# EAGLE design spoke-motor (EAGLE 5.10)
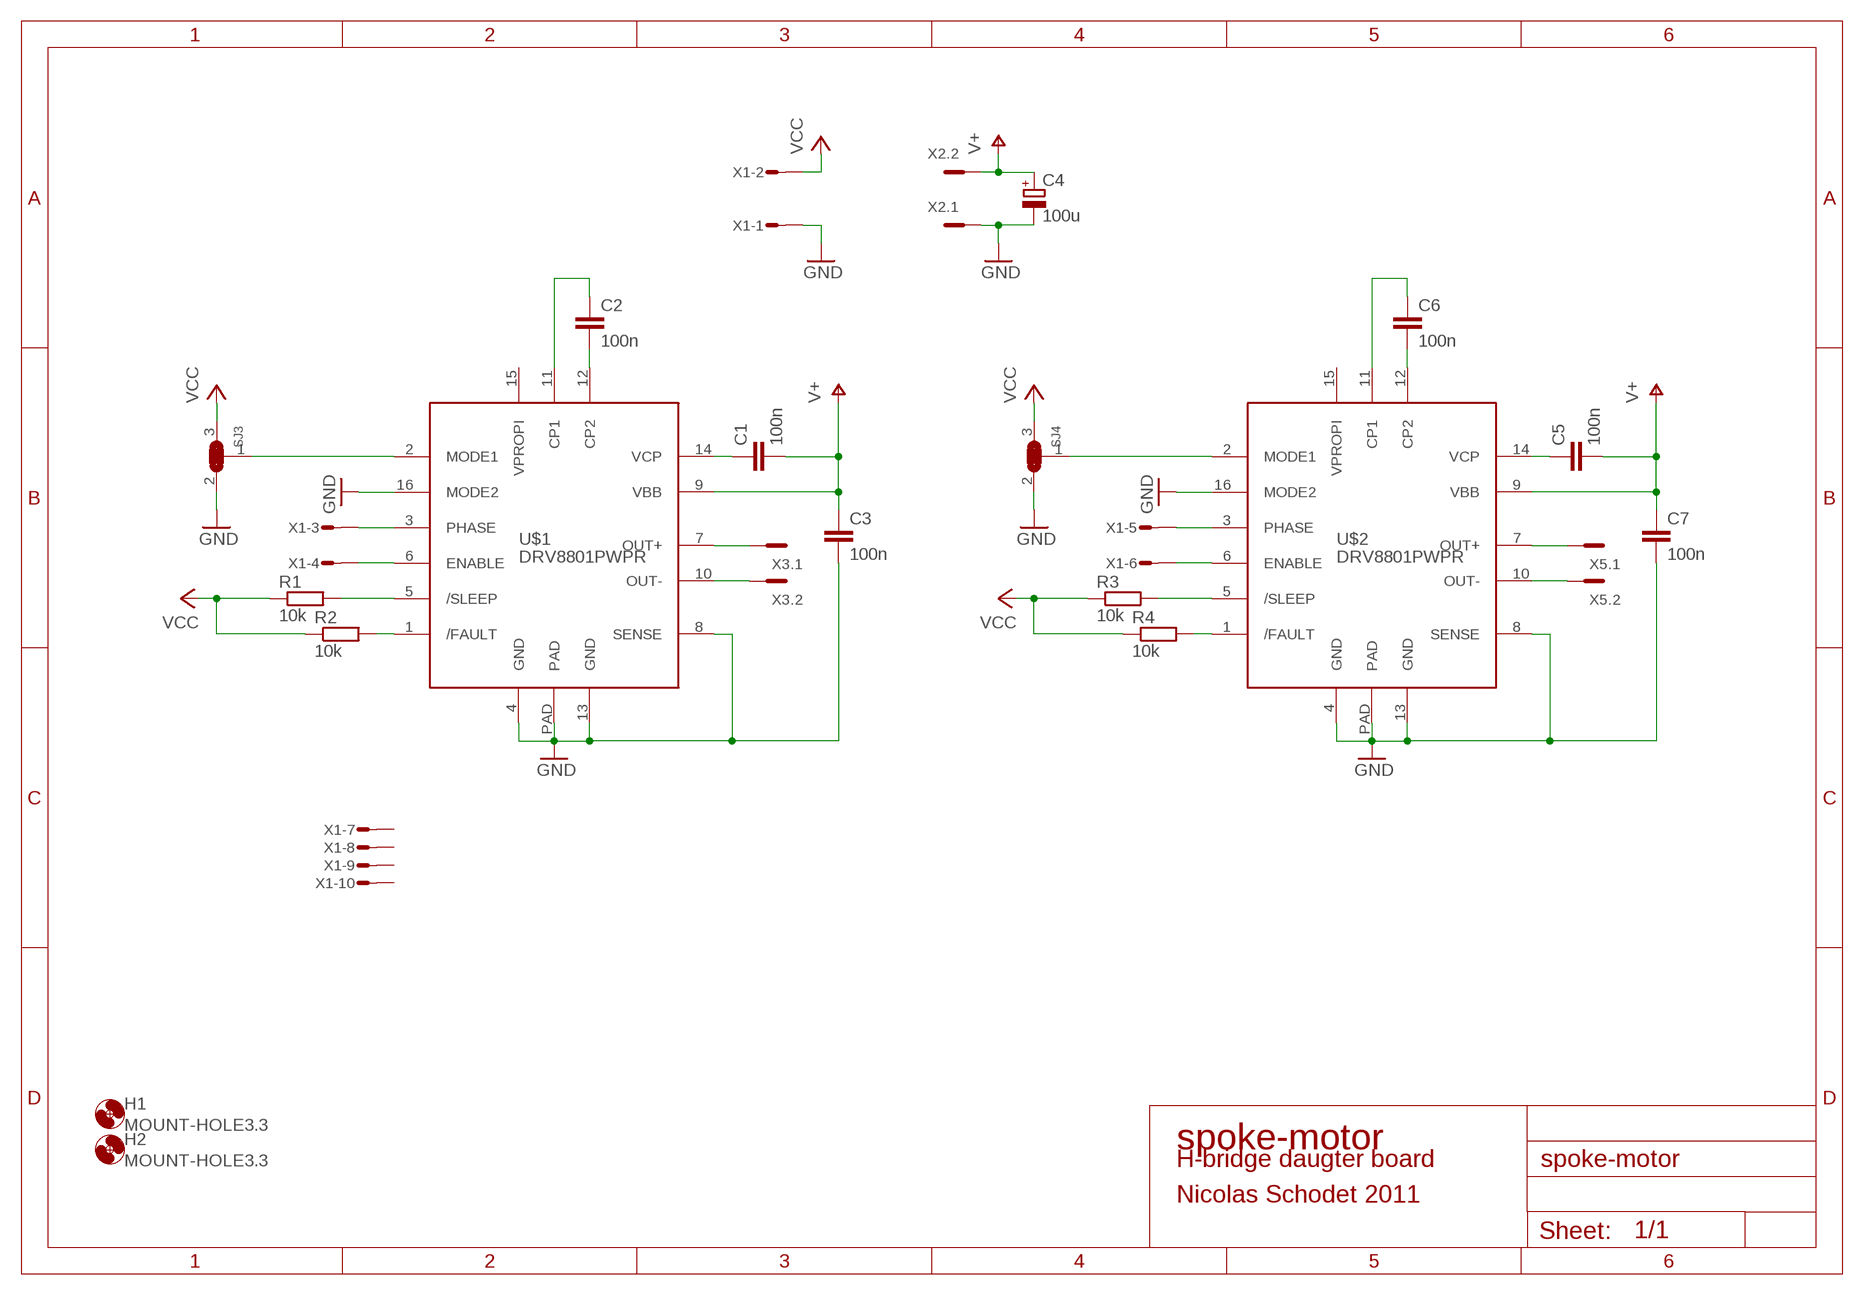
[diagram p0: schematic, sheet 1]

## Parts
C1  100n  C-EUC0603  [C0603]
C2  100n  C-EUC0603  [C0603]
C3  100n  C-EUC0603  [C0603]
C4  100u  CPOL-EUE3.5-8  [E3,5-8]
C5  100n  C-EUC0603  [C0603]
C6  100n  C-EUC0603  [C0603]
C7  100n  C-EUC0603  [C0603]
H1  MOUNT-HOLE3.3  [3,3]
H2  MOUNT-HOLE3.3  [3,3]
R1  10k  R-EU_R0603  [R0603]
R2  10k  R-EU_R0603  [R0603]
R3  10k  R-EU_R0603  [R0603]
R4  10k  R-EU_R0603  [R0603]
SJ3  SJ2SMD  [SJ2-SMD]
SJ4  SJ2SMD  [SJ2-SMD]
U$1  DRV8801PWPR  [HTSSOP16]
U$2  DRV8801PWPR  [HTSSOP16]
X1  MICROMATCH-10  [MICROMATCH-10]
X2  MC2  [MC2]
X3  MC2  [MC2]
X5  MC2  [MC2]

## Nets
CP10: C2.1 U$1.11(CP1)
CP11: C6.1 U$2.11(CP1)
CP20: C2.2 U$1.12(CP2)
CP21: C6.2 U$2.12(CP2)
ENABLE0: U$1.6(ENABLE) X1.4
ENABLE1: U$2.6(ENABLE) X1.6
FAULT0: R2.2 U$1.1(/FAULT)
FAULT1: R4.2 U$2.1(/FAULT)
GND [supply]: C3.2 C4.- C7.2 SJ3.2 SJ4.2 U$1.4(GND) U$1.8(SENSE) U$1.13(GND) U$1.16(MODE2) U$1.PAD U$2.4(GND) U$2.8(SENSE) U$2.13(GND) U$2.16(MODE2) U$2.PAD X1.1 X2.1
M0: U$1.10(OUT-) X3.2
M1: U$2.10(OUT-) X5.2
MODE10: SJ3.1 U$1.2(MODE1)
MODE11: SJ4.1 U$2.2(MODE1)
P0: U$1.7(OUT+) X3.1
P1: U$2.7(OUT+) X5.1
PHASE0: U$1.3(PHASE) X1.3
PHASE1: U$2.3(PHASE) X1.5
SLEEP0: R1.2 U$1.5(/SLEEP)
SLEEP1: R3.2 U$2.5(/SLEEP)
V+: C1.2 C3.1 C4.+ C5.2 C7.1 U$1.9(VBB) U$2.9(VBB) X2.2
VCC: R1.1 R2.1 R3.1 R4.1 SJ3.3 SJ4.3 X1.2
VCP0: C1.1 U$1.14(VCP)
VCP1: C5.1 U$2.14(VCP)
Unconnected: U$1.15(VPROPI) U$2.15(VPROPI) X1.7 X1.8 X1.9 X1.10

## Notes on the sheet
- spoke-motor
- H-bridge daugter board
- Nicolas Schodet 2011

## Library data of the parts
C1-C3 C5-C7 = rcl:C-EU: CAPACITOR, European symbol
C4 = rcl:CPOL-EU: POLARIZED CAPACITOR, European symbol
H1 H2 = holes:MOUNT-HOLE: MOUNTING HOLE with drill center marker
R1-R4 = apbteam_rcl:R-EU_: RESISTOR, European symbol
SJ3 SJ4 = apbteam_jumper:SJ2: Jumper, 2 ways
U$1 U$2 = igeek:DRV8801: TI DRV8801 DMOS FULL-BRIDGE MOTOR DRIVER
X1 = apbteam_con-amp-micromatch:MICROMATCH-10: MicroMaTch 10
X2 X3 X5 = con-phoenix-381_l:MC2: Mini-Combicon 3.81mm horizontal 2-polig MC 1,5/2-G-3,81 Artikel-Nr. 1803277

## Net classes
1 supply: width 0.254 mm

## Board
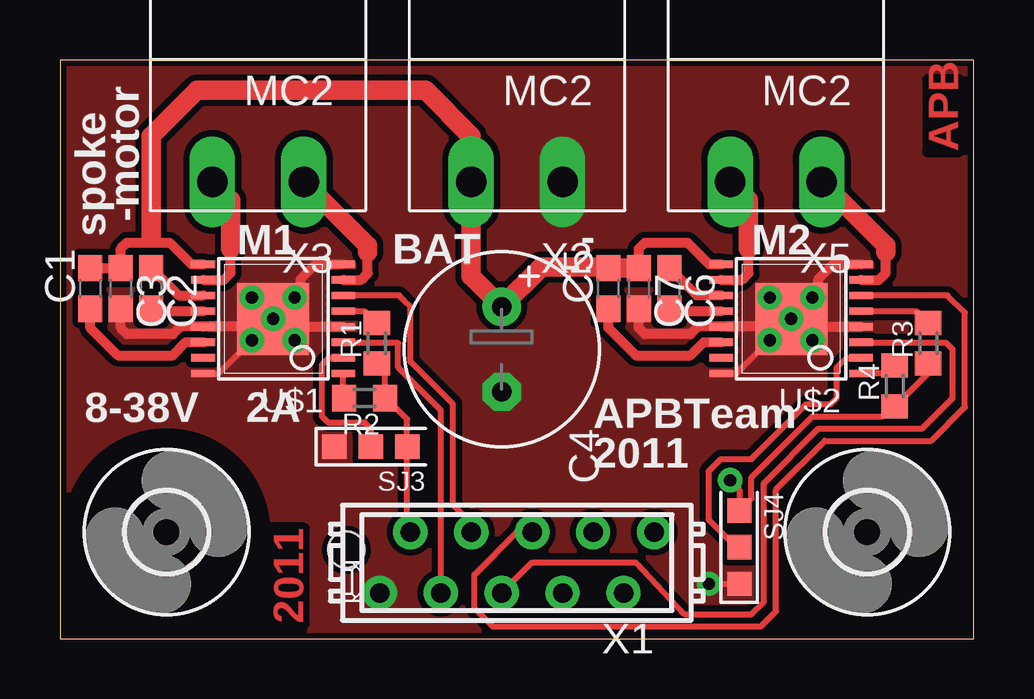
[diagram p1: board, top side]
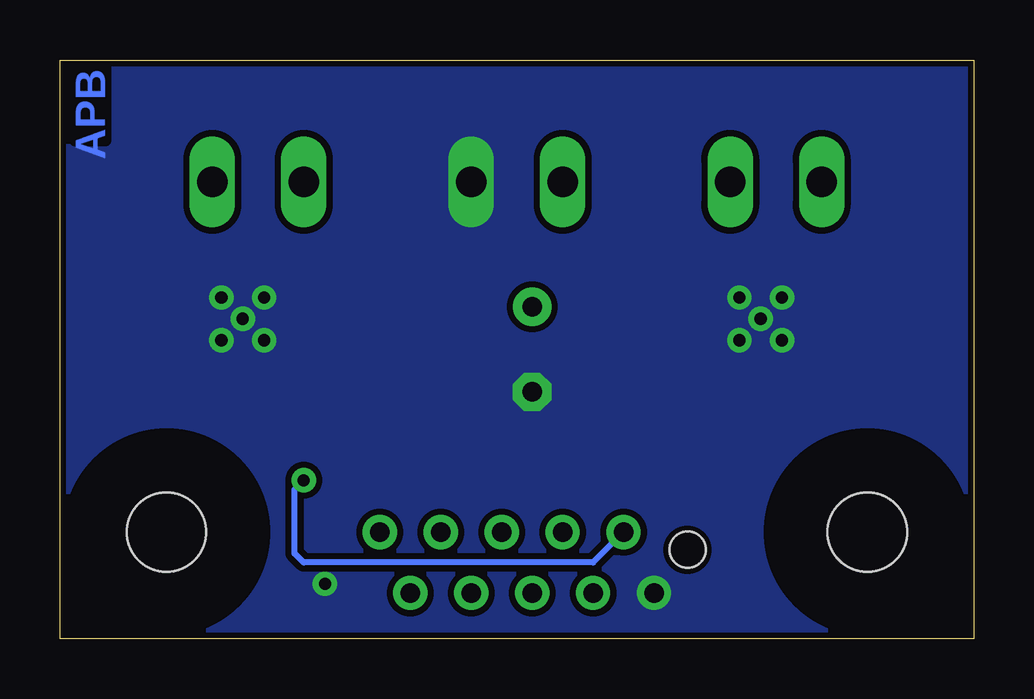
[diagram p2: board, bottom side, seen from below]

Size 38.1 x 24.13 mm. Coordinates in mm from the lower left corner, seen from the top.
Outline: 0,0 38.1,0 38.1,24.13 0,24.13 0,0
Copper layers (1*16): Top 0.035mm / dielectric 1.5mm / Bottom 0.035mm
Design rules "SparkFun *": minimum track width 8mil, minimum drill 20mil, track to track 8mil, track to pad 8mil, pad to pad 8mil, via to via 8mil, smd to smd 8mil, copper to edge 10mil, drill to drill 8mil, minimum pad ring 12mil, minimum via ring 10mil, stop-mask expansion 4mil, vias tented up to drill 25mil, thermal gap 10mil

### Footprints (pad centres in the part's own frame; a part is rotated, then mirrored left to right if it is on the bottom)
C0603 = smd 1.1 x 1: 1 -0.85,0; 2 0.85,0
E3,5-8 = drill 0.813 pad 1.6 round: + -1.778,0 | drill 0.813 pad 1.6 octagon: - 1.778,0
3,3 = hole 3.3: 0,0
R0603 = smd 1 x 1.1: 1 -0.85,0; 2 0.85,0
SJ2-SMD = smd 1.016 x 1.016: 1 0,0; 2 -1.524,0; 3 1.524,0
HTSSOP16 = smd 0.305 x 0.991: 1 -2.275,-2.918; 2 -1.625,-2.918; 3 -0.975,-2.918; 4 -0.325,-2.918; 5 0.325,-2.918; 6 0.975,-2.918; 7 1.625,-2.918; 8 2.275,-2.918; 9 2.275,2.918; 10 1.625,2.918; 11 0.975,2.918; 12 0.325,2.918; 13 -0.325,2.918; 14 -0.975,2.918; 15 -1.625,2.918; 16 -2.275,2.918 | smd 3 x 3: PAD 0,0
MICROMATCH-10 = drill 0.813 round: 1 5.715,1.27; 2 4.445,-1.27; 3 3.175,1.27; 4 1.905,-1.27; 5 0.635,1.27; 6 -0.635,-1.27; 7 -1.905,1.27; 8 -3.175,-1.27; 9 -4.445,1.27; 10 -5.715,-1.27 | hole 1.5: 7.11,-0.53
MC2 = drill 1.27 long: 1 -1.905,0; 2 1.905,0

### Placement (x,y rotation side)
C1  1.27,14.61 90 top
C2  3.81,14.61 270 top
C3  2.54,14.61 270 top
C4  18.41,12.06 270 top
C5  22.86,14.61 90 top
C6  25.4,14.61 270 top
C7  24.13,14.61 270 top
H1  4.45,4.45 0 top
H2  33.66,4.45 0 top
R1  13.21,12.32 90 top
R2  12.7,10.03 180 top
R3  36.2,12.32 90 top
R4  34.8,10.54 90 top
SJ3  12.95,8 0 top
SJ4  28.32,3.81 90 top
U$1  8.89,13.34 90 top
U$2  30.48,13.34 90 top
X1  19.05,3.17 180 top
X2  19.05,19.05 180 top
X3  8.26,19.05 180 top
X5  29.84,19.05 180 top

### Tracks (layer width: path | path; a pad name or v marks a point on that pad's centre or on a via)
CP10
  Top 0.406: U$1.11 4.96,14.31 C2.1
CP11
  Top 0.406: U$2.11 26.55,14.31 C6.1
CP20
  Top 0.406: U$1.12 3.9,13.66 C2.2
CP21
  Top 0.406: U$2.12 25.5,13.66 C6.2
ENABLE0
  Top 0.254: X1.4 17.14,4.83 16.38,5.59 16.38,9.78 14.61,11.56 14.61,13.84 14.35,14.1 14.14,14.31 U$1.6
ENABLE1
  Top 0.254: X1.6 19.05,4.45 17.27,2.67 17.27,1.27 18.03,0.51 29.21,0.51 29.84,1.14 29.84,6.22 31.88,8.26 36.32,8.26 37.72,9.65 37.72,13.59 37,14.31 U$2.6
FAULT0
  Top 0.254: U$1.1 11.81,10.07 R2.2
FAULT1
  Top 0.254: U$2.1 34.47,11.06 R4.2
GND  (via drill 0.51)
  Top 0.254: U$1.16 6.62,11.06 v8,12.45 | U$2.16 28.2,11.06 v29.59,12.45 | v27.05,2.29 SJ4.2
  Top 0.406: C3.2 2.54,12.95 2.79,12.7 4.7,12.7 5.01,13.01 U$1.13 8.51,13.01 | 8.51,13.01 8.56,13.01 U$1.PAD | U$1.4 9.21,13.01 U$1.PAD | U$1.8 10.66,15.61 10.03,14.99 10.03,14.48 v9.78,14.22 U$1.PAD | U$1.PAD v8,14.22 | v8,12.45 8,12.5 8.51,13.01 | U$1.PAD v9.78,12.45 | U$2.4 30.8,13.01 U$2.PAD | 30.1,13.01 U$2.13 26.6,13.01 26.29,12.7 24.38,12.7 24.13,12.95 C7.2 | 30.1,13.01 30.16,13.01 U$2.PAD | U$2.8 32.25,15.61 31.62,14.99 31.62,14.48 v31.37,14.22 U$2.PAD | U$2.PAD v31.37,12.45 | v29.59,12.45 29.59,12.5 30.1,13.01 | U$2.PAD v29.59,14.22
  other vias: 8.89,13.34 30.48,13.34
  pour Top (isolate 0.254, no thermals): 0,24.13 38.1,24.13 38.1,0 0,0
  pour Bottom (isolate 0.254, no thermals): 0,24.13 38.1,24.13 38.1,0 0,0
M0
  Top 0.406: U$1.10 6.83,14.96 7.11,15.24 7.11,16.26
  Top 0.813: 7.11,16.26 7.11,18.29 X3.2
M1
  Top 0.406: U$2.10 28.42,14.96 28.7,15.24 28.7,16.26
  Top 0.813: 28.7,16.26 28.7,18.29 X5.2
MODE10
  Top 0.254: U$1.2 11.2,11.71 10.92,11.43 10.92,9.27 11.18,9.02 12.7,9.02 12.95,8.76 SJ3.1
MODE11
  Top 0.254: U$2.2 32.79,11.71 32.38,11.3 32.38,10.03 32.13,9.78 31.11,9.78 28.83,7.49 27.56,7.49 27.05,6.99 27.05,4.95 28.19,3.81 SJ4.1
P0
  Top 0.406: U$1.7 12.55,14.96 12.83,15.24 12.83,16.13
  Top 0.813: 12.83,16.13 12.83,16.38 X3.1
P1
  Top 0.406: U$2.7 34.14,14.96 34.42,15.24 34.42,16.13
  Top 0.813: 34.42,16.13 34.42,16.38 X5.1
PHASE0
  Top 0.254: X1.3 15.88,9.14 15.88,9.53 14.1,11.3 14.1,12.32 11.85,12.32 U$1.3
PHASE1
  Top 0.254: X1.5 19.68,3.17 24,3.17 26.04,1.02 28.83,1.02 29.34,1.52 29.34,6.48 31.62,8.76 35.94,8.76 37.21,10.03 37.21,12.06 36.96,12.32 33.78,12.32 33.74,12.36 U$2.3
SLEEP0
  Top 0.254: U$1.5 12.72,13.66 R1.2
SLEEP1
  Top 0.254: U$2.5 35.7,13.66 R3.2
V+
  Top 0.406: U$1.9 5.47,15.61 4.57,16.51 3.81,16.51 | 3.81,16.51 2.79,16.51 2.54,16.26 C3.1 C1.2 | U$2.9 27.06,15.61 26.16,16.51 24.38,16.51 24.13,16.26 C7.1 | 3.81,16.51 3.81,16.76
  Top 0.813: C5.2 C7.1 | 3.81,16.76 3.81,20.95 5.71,22.86 15.24,22.86 17.14,20.95 X2.2 17.14,15.11 C4.+ 20.07,15.49 22.82,15.49 C5.2 | C5.2 22.77,15.37
VCC  (via drill 0.51)
  Top 0.254: R3.1 36.2,11.09 R4.1 34.71,9.69 34.29,9.27 31.37,9.27 28.83,6.73 28.83,5.84 SJ4.3 28.32,6.22 v27.94,6.6 | R1.1 13.55,11.13 R2.1 13.55,9.95 13.68,9.95 14.48,9.14 SJ3.3 14.48,4.57 X1.2
  Bottom 0.254: v27.94,6.6 28.32,6.22 28.32,3.56 27.94,3.17 15.88,3.17 X1.2
VCP0
  Top 0.406: U$1.14 5.25,12.36 4.7,11.81 2.41,11.81 1.27,12.95 C1.1
VCP1
  Top 0.406: U$2.14 26.84,12.36 26.29,11.81 24,11.81 22.86,12.95 C5.1

### Text on the board
Top: APB | 2011
Bottom: APB
tSilk: spoke | -motor | M1 | BAT | - | M2 | 8-38V | 2A | APBTeam | 2011